# Altium schematic sheet Sheet0-MCU.SchDoc
size A3; SheetNumber: 1; SheetTotal: 4
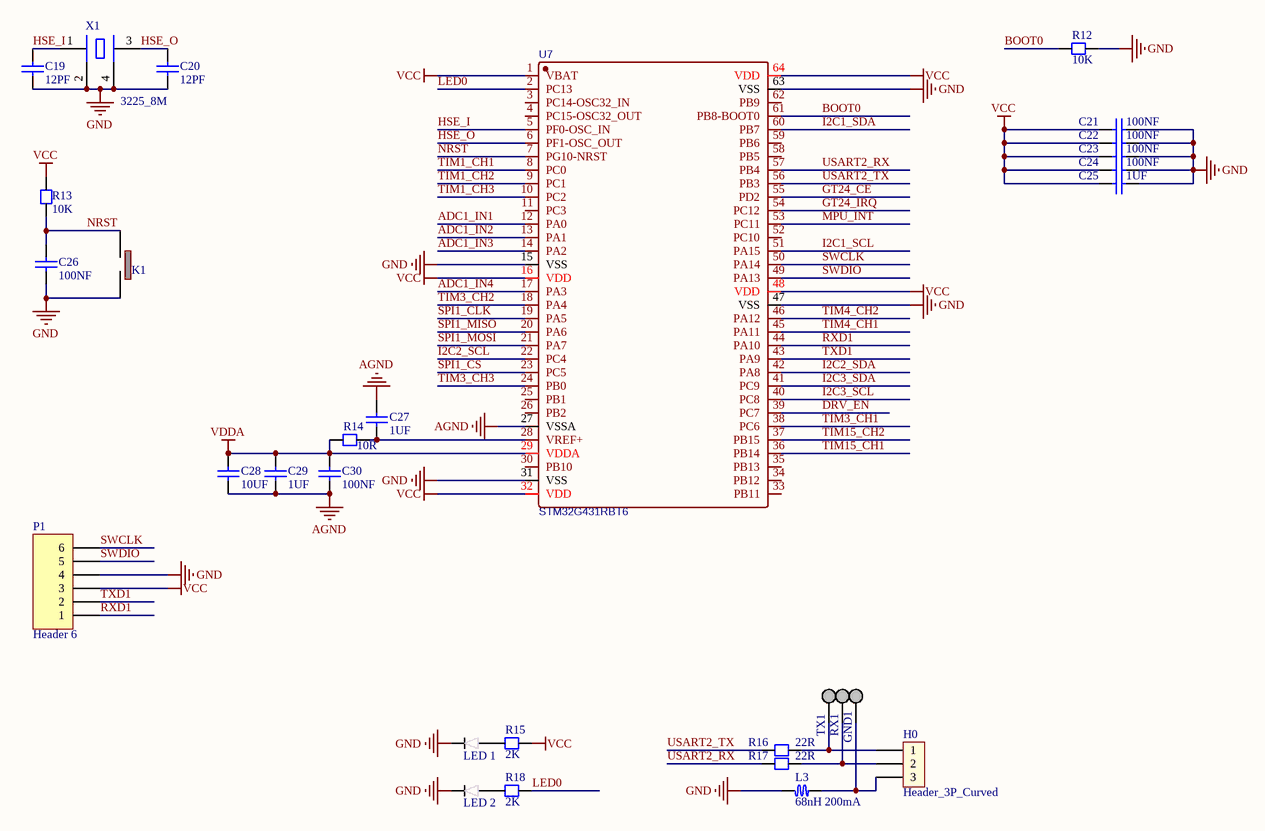
[diagram p0: Sheet0-MCU.SchDoc]

## Parts
C19  12PF  [CC1608-0603]
C20  12PF  [CC1608-0603]
C21  100NF  [CC1608-0603]
C22  100NF  [CC1608-0603]
C23  100NF  [CC1608-0603]
C24  100NF  [CC1608-0603]
C25  1UF  [CC1608-0603]
C26  100NF  [CC1608-0603]
C27  1UF  [CC1608-0603]
C28  10UF  [CC1608-0603]
C29  1UF  [CC1608-0603]
C30  100NF  [CC1608-0603]
GND1  test  [test]  (value not drawn)
H0  Header_3P_Curved  [Header_2_54_3PW]
K1  KEY 3*4  [KEY 3*4]  (value not drawn)
L3  68nH 200mA  [Inductor-0603]
LED_1  LED 0603  [LED 0603]  (value not drawn)
LED_2  LED 0603  [LED 0603]  (value not drawn)
P1  Header 6  [HDR1X6]
R12  10K  [CR1608-0603]
R13  10K  [CR1608-0603]
R14  10R  [CR1608-0603]
R15  2K  [CR1608-0603]
R16  22R  [CR1608-0603]
R17  22R  [CR1608-0603]
R18  2K  [CR1608-0603]
RX1  test  [test]  (value not drawn)
TX1  test  [test]  (value not drawn)
U7  STM32G431RBT6  [LQFP-64]
X1  3225_8M  [XTAL-3225]

## Nets
AGND: C27.1 C28.1 C29.1 C30.1 U7.27(VSSA)
GND: C19.1 C20.1 C21.1 C22.1 C23.1 C24.1 C25.1 C26.1 K1.2 L3.2 LED_1.2 LED_2.2 P1.4 R12.1 U7.15(VSS) U7.31(VSS) U7.47(VSS) U7.63(VSS) X1.2(GND) X1.4(GND)
VCC: C21.2 C22.2 C23.2 C24.2 C25.2 P1.3 R13.2 R15.2 U7.1(VBAT) U7.16(VDD) U7.32(VDD) U7.48(VDD) U7.64(VDD)
VDDA: C28.2 C29.2 C30.2 R14.2 U7.29(VDDA)
ADC1_IN1: U7.12(PA0)
ADC1_IN2: U7.13(PA1)
ADC1_IN3: U7.14(PA2)
ADC1_IN4: U7.17(PA3)
BOOT0: R12.2 U7.61(PB8-BOOT0)
DRV_EN: U7.39(PC7)
GT24_CE: U7.55(PD2)
GT24_IRQ: U7.54(PC12)
HSE_I: C19.2 U7.5(PF0-OSC_IN) X1.1(OSC1)
HSE_O: C20.2 U7.6(PF1-OSC_OUT) X1.3(OSC2)
I2C1_SCL: U7.51(PA15)
I2C1_SDA: U7.60(PB7)
I2C2_SCL: U7.22(PC4)
I2C2_SDA: U7.42(PA8)
I2C3_SCL: U7.40(PC8)
I2C3_SDA: U7.41(PC9)
LED0: R18.2 U7.2(PC13)
MPU_INT: U7.53(PC11)
NRST: C26.2 K1.1 R13.1 U7.7(PG10-NRST)
RXD1: P1.1 U7.44(PA10)
SPI1_CLK: U7.19(PA5)
SPI1_CS: U7.23(PC5)
SPI1_MISO: U7.20(PA6)
SPI1_MOSI: U7.21(PA7)
SWCLK: P1.6 U7.50(PA14)
SWDIO: P1.5 U7.49(PA13)
TIM1_CH1: U7.8(PC0)
TIM1_CH2: U7.9(PC1)
TIM1_CH3: U7.10(PC2)
TIM3_CH1: U7.38(PC6)
TIM3_CH2: U7.18(PA4)
TIM3_CH3: U7.24(PB0)
TIM4_CH1: U7.45(PA11)
TIM4_CH2: U7.46(PA12)
TIM15_CH1: U7.36(PB14)
TIM15_CH2: U7.37(PB15)
TXD1: P1.2 U7.43(PA9)
USART2_RX: R17.1 U7.57(PB4)
USART2_TX: R16.1 U7.56(PB3)
NetC27_2: C27.2 R14.1 U7.28(VREF+)
NetGND1_0: GND1.0 H0.3 L3.1
NetH0_1: H0.1 R16.2 TX1.0
NetH0_2: H0.2 R17.2 RX1.0
NetLED_1_1: LED_1.1 R15.1
NetLED_2_1: LED_2.1 R18.1

Not connected (* = marked no-connect by the designer): U7 3(PC14-OSC32_IN) 4(PC15-OSC32_OUT) 11(PC3) 25(PB1) 26(PB2) 30(PB10) 33(PB11) 34(PB12) 35(PB13) 52(PC10) 58(PB5) 59(PB6) 62(PB9)

## Library data of the parts
C19-C30 = Cap Chip 0603: 0603封装的电容; Published: 8-Jun-2000; Revision: July-2002: Re-released for DXP Platform.; Publisher: Altium Limited
GND1 RX1 TX1 = test: 测试点
H0 = Header_3P_Curved: 弯的3P排针
K1 = KEY 3*4: 轻触开关按键
L3 = Inductor-0603: 贴片电感 0603封装
P1 = Header 6: Header, 6-Pin; LatestRevisionDate: 17-Jul-2002; LatestRevisionNote: Re-released for DXP Platform.; Publisher: Altium Limited
R12-R18 = Resistor Chip 0603: 0603封装电阻; Published: 8-Jun-2000; Revision: July-2002: Re-released for DXP Platform.; Publisher: Altium Limited
U7 = STM32G431RBT6: Manufacturer: ST(意法半导体); Contributor: LCSC; Supplier: LCSC; Supplier Part: C431633; Manufacturer Part: STM32G431RBT6; JLCPCB Part Class: Extended Part; spicePre: U; spiceSymbolName: STM32G431RBT6
X1 = XTAL 3225: 3225封装的晶振